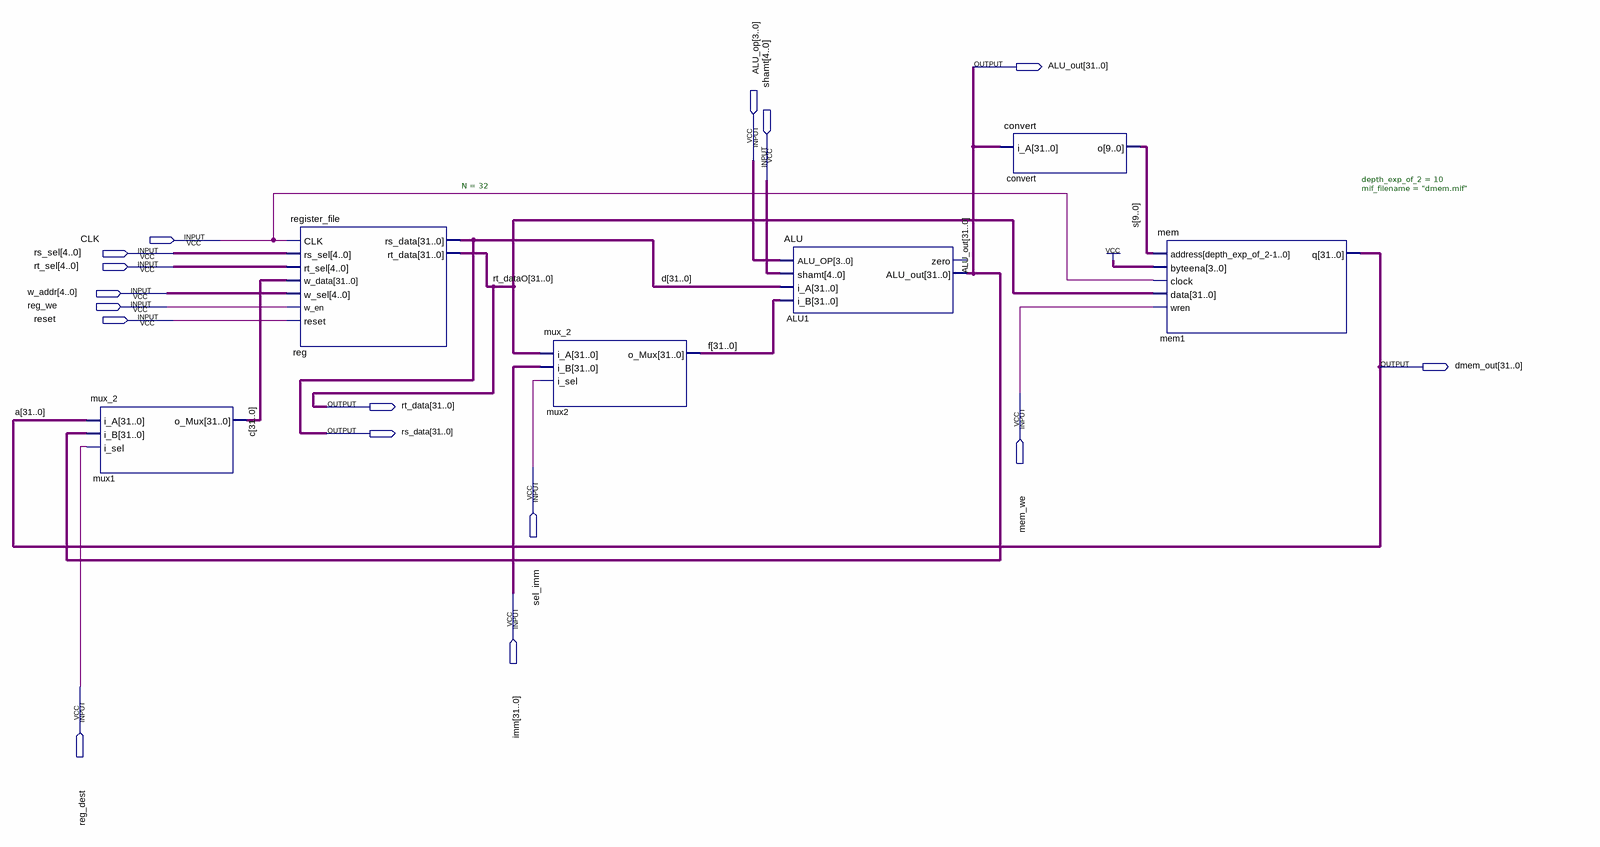
[diagram p0: schematic sheet]
// Quartus schematic simplifiedMipsProcessor.bdf as structural Verilog: 6 symbols, 16 pins
module simplifiedMipsProcessor (
  input  [3:0] ALU_op,
  input  [4:0] shamt,
  input  CLK,
  input  [4:0] rs_sel,
  input  [4:0] rt_sel,
  input  [4:0] w_addr,
  input  reg_we,
  input  reset,
  input  mem_we,
  input  sel_imm,
  input  [31:0] imm,
  input  reg_dest,
  output [31:0] ALU_out,
  output [31:0] dmem_out,
  output [31:0] rt_data,
  output [31:0] rs_data
);

  wire [9:0] s;
  wire [31:0] c, f;

  mux_2 mux1 (.i_A(dmem_out), .i_B(ALU_out), .i_sel(reg_dest), .o_Mux(c));
  register_file #(.N(32)) \reg  (
    .CLK(CLK), .rs_sel(rs_sel), .rt_sel(rt_sel), .w_data(c), .w_sel(w_addr), .w_en(reg_we), .reset(reset),
    .rs_data(rs_data), .rt_data(rt_data));
  mux_2 mux2 (.i_A(rt_data), .i_B(imm), .i_sel(sel_imm), .o_Mux(f));
  ALU ALU1 (.ALU_OP(ALU_op), .shamt(shamt), .i_A(rs_data), .i_B(f), .ALU_out(ALU_out));  // open: zero
  convert convert (.i_A(ALU_out), .o(s));
  mem #(.depth_exp_of_2(10), .mif_filename("dmem.mif")) mem1 (
    .address(s), .byteena(4'b1111), .clock(CLK), .data(rt_data), .wren(mem_we), .q(dmem_out));

  // Other names for the same wires on the sheet: a[31:0] = dmem_out; d[31:0] = rs_data; rt_dataO[31:0] = rt_data
endmodule
